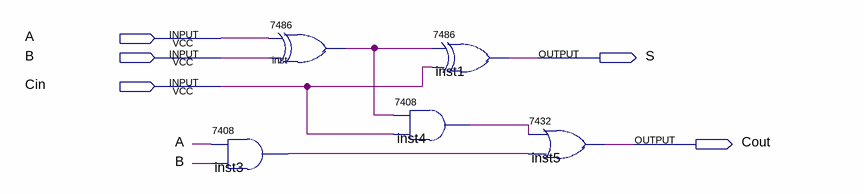
[diagram p0: schematic sheet]
// Quartus schematic FullAdder.bdf as structural Verilog: 5 symbols, 5 pins
module FullAdder (
  input  A,
  input  B,
  input  Cin,
  output S,
  output Cout
);

  wire inst3_1, inst4_1, inst_1;

  \7486  inst (.\2 (A), .\3 (B), .\1 (inst_1));
  \7408  inst3 (.\3 (B), .\2 (A), .\1 (inst3_1));
  \7408  inst4 (.\3 (Cin), .\2 (inst_1), .\1 (inst4_1));
  \7486  inst1 (.\2 (inst_1), .\3 (Cin), .\1 (S));
  \7432  inst5 (.\2 (inst4_1), .\3 (inst3_1), .\1 (Cout));
endmodule
